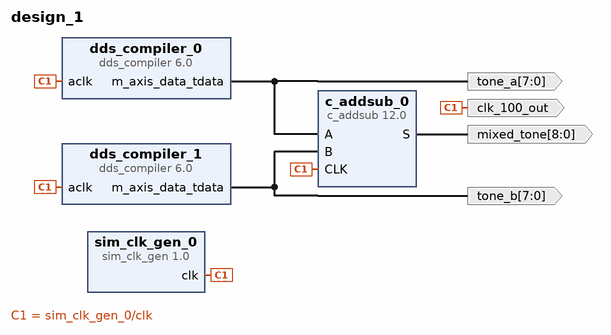
[diagram p0: block diagram of the top level]
# Vivado block design design_1, xc7z020clg484-1, Vivado 2025.1
create_bd_design design_1

create_bd_port -dir O -from 7 -to 0 -type data tone_a
create_bd_port -dir O -from 7 -to 0 -type data tone_b
create_bd_port -dir O -from 8 -to 0 -type data mixed_tone
create_bd_port -dir O -type clk clk_100_out

create_bd_cell -type ip -vlnv xilinx.com:ip:dds_compiler:6.0 dds_compiler_0
set_property -dict [list \
  CONFIG.Has_Phase_Out false \
  CONFIG.M_DATA_Has_TUSER Not_Required \
  CONFIG.Output_Frequency1 .5 \
  CONFIG.Output_Selection Sine \
  CONFIG.PINC1 101000111101011100001 \
] [get_bd_cells dds_compiler_0]
create_bd_cell -type ip -vlnv xilinx.com:ip:dds_compiler:6.0 dds_compiler_1
set_property -dict [list \
  CONFIG.Has_Phase_Out false \
  CONFIG.M_DATA_Has_TUSER Not_Required \
  CONFIG.Output_Frequency1 10 \
  CONFIG.Output_Selection Sine \
  CONFIG.PINC1 1100110011001100110011001 \
] [get_bd_cells dds_compiler_1]
create_bd_cell -type ip -vlnv xilinx.com:ip:sim_clk_gen:1.0 sim_clk_gen_0
create_bd_cell -type ip -vlnv xilinx.com:ip:c_addsub:12.0 c_addsub_0
set_property -dict [list \
  CONFIG.A_Type Signed \
  CONFIG.A_Width 8 \
  CONFIG.B_Type Signed \
  CONFIG.B_Value 00000000 \
  CONFIG.B_Width 8 \
  CONFIG.CE false \
  CONFIG.Implementation DSP48 \
  CONFIG.Latency 1 \
  CONFIG.Out_Width 9 \
] [get_bd_cells c_addsub_0]

# ---- connections ----

connect_bd_net [get_bd_pins c_addsub_0/S] [get_bd_ports mixed_tone]
connect_bd_net [get_bd_pins dds_compiler_0/m_axis_data_tdata] [get_bd_pins c_addsub_0/A] [get_bd_ports tone_a]
connect_bd_net [get_bd_pins dds_compiler_1/m_axis_data_tdata] [get_bd_pins c_addsub_0/B] [get_bd_ports tone_b]
connect_bd_net [get_bd_pins sim_clk_gen_0/clk] \
  [get_bd_pins dds_compiler_0/aclk] [get_bd_pins dds_compiler_1/aclk] [get_bd_pins c_addsub_0/CLK] [get_bd_ports clk_100_out]

validate_bd_design
save_bd_design
